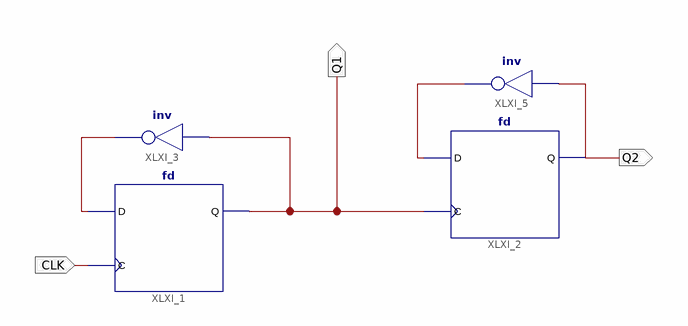
[diagram p0: schematic sheet 1]
// Xilinx ISE schematic DIV_CIR.sch (spartan6) as structural Verilog: 4 symbols, 3 ports
module DIV_CIR (
  input  CLK,
  output Q1,
  output Q2
);

  wire XLXN_3, XLXN_6;

  fd XLXI_1 (.C(CLK), .D(XLXN_3), .Q(Q1));
  fd XLXI_2 (.C(Q1), .D(XLXN_6), .Q(Q2));
  not XLXI_3 (XLXN_3, Q1);
  not XLXI_5 (XLXN_6, Q2);
endmodule
